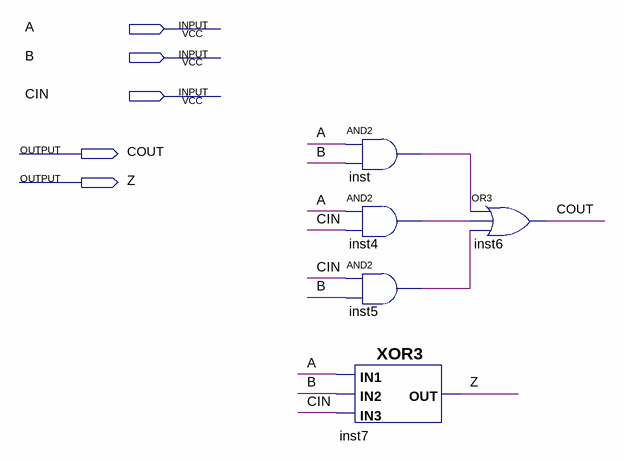
[diagram p0: schematic sheet]
// Quartus schematic SUM2.bdf as structural Verilog: 5 symbols, 5 pins
module SUM2 (
  input  A,
  input  B,
  input  CIN,
  output COUT,
  output Z
);

  wire inst4_out, inst5_out, inst_out;

  and inst (inst_out, A, B);
  and inst4 (inst4_out, A, CIN);
  and inst5 (inst5_out, CIN, B);
  XOR3 inst7 (.IN3(CIN), .IN1(A), .IN2(B), .OUT(Z));
  or inst6 (COUT, inst_out, inst4_out, inst5_out);
endmodule
